# EAGLE design sch_THT (EAGLE 8.0.1)
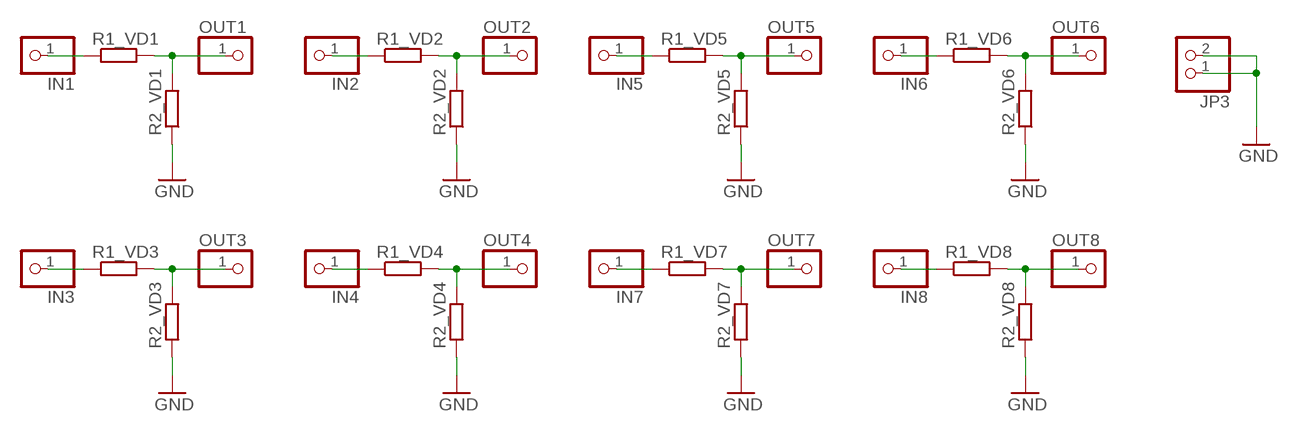
[diagram p0: schematic, sheet 1]

## Parts
IN1  PINHD-1X1  [1X01]
IN2  PINHD-1X1  [1X01]
IN3  PINHD-1X1  [1X01]
IN4  PINHD-1X1  [1X01]
IN5  PINHD-1X1  [1X01]
IN6  PINHD-1X1  [1X01]
IN7  PINHD-1X1  [1X01]
IN8  PINHD-1X1  [1X01]
JP3  PINHD-1X2  [1X02]
OUT1  PINHD-1X1  [1X01]
OUT2  PINHD-1X1  [1X01]
OUT3  PINHD-1X1  [1X01]
OUT4  PINHD-1X1  [1X01]
OUT5  PINHD-1X1  [1X01]
OUT6  PINHD-1X1  [1X01]
OUT7  PINHD-1X1  [1X01]
OUT8  PINHD-1X1  [1X01]
R1_VD1  R-EU_0204/7  [0204/7]
R1_VD2  R-EU_0204/7  [0204/7]
R1_VD3  R-EU_0204/7  [0204/7]
R1_VD4  R-EU_0204/7  [0204/7]
R1_VD5  R-EU_0204/7  [0204/7]
R1_VD6  R-EU_0204/7  [0204/7]
R1_VD7  R-EU_0204/7  [0204/7]
R1_VD8  R-EU_0204/7  [0204/7]
R2_VD1  R-EU_0204/7  [0204/7]
R2_VD2  R-EU_0204/7  [0204/7]
R2_VD3  R-EU_0204/7  [0204/7]
R2_VD4  R-EU_0204/7  [0204/7]
R2_VD5  R-EU_0204/7  [0204/7]
R2_VD6  R-EU_0204/7  [0204/7]
R2_VD7  R-EU_0204/7  [0204/7]
R2_VD8  R-EU_0204/7  [0204/7]

## Nets
GND: JP3.1 JP3.2 R2_VD1.1 R2_VD2.1 R2_VD3.1 R2_VD4.1 R2_VD5.1 R2_VD6.1 R2_VD7.1 R2_VD8.1
N$1: IN1.1 R1_VD1.1
N$2: OUT1.1 R1_VD1.2 R2_VD1.2
N$3: IN2.1 R1_VD2.1
N$4: OUT2.1 R1_VD2.2 R2_VD2.2
N$5: IN3.1 R1_VD3.1
N$6: OUT3.1 R1_VD3.2 R2_VD3.2
N$7: IN4.1 R1_VD4.1
N$8: OUT4.1 R1_VD4.2 R2_VD4.2
N$9: IN5.1 R1_VD5.1
N$10: OUT5.1 R1_VD5.2 R2_VD5.2
N$11: IN6.1 R1_VD6.1
N$12: OUT6.1 R1_VD6.2 R2_VD6.2
N$13: IN7.1 R1_VD7.1
N$14: OUT7.1 R1_VD7.2 R2_VD7.2
N$15: IN8.1 R1_VD8.1
N$16: OUT8.1 R1_VD8.2 R2_VD8.2

## Library data of the parts
IN1-IN8 OUT1-OUT8 = pinhead:PINHD-1X1: PIN HEADER
JP3 = pinhead:PINHD-1X2: PIN HEADER
R1_VD1-R1_VD8 R2_VD1-R2_VD8 = rcl:R-EU_: RESISTOR, European symbol

## Net classes
0 default: drill 0.381 mm

## Board
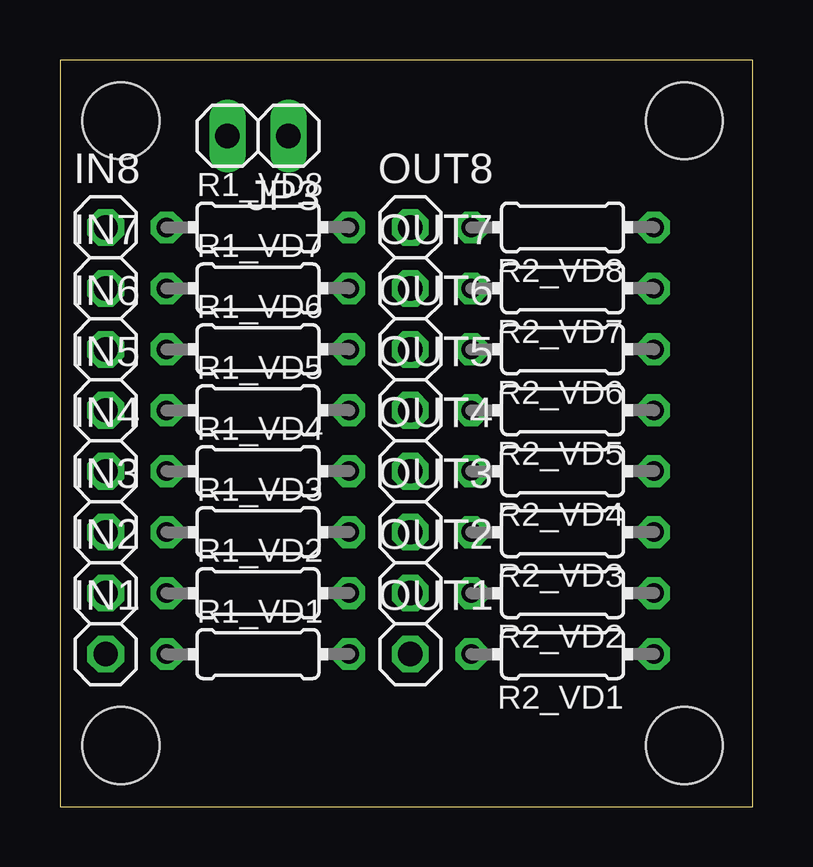
[diagram p1: board, top side]
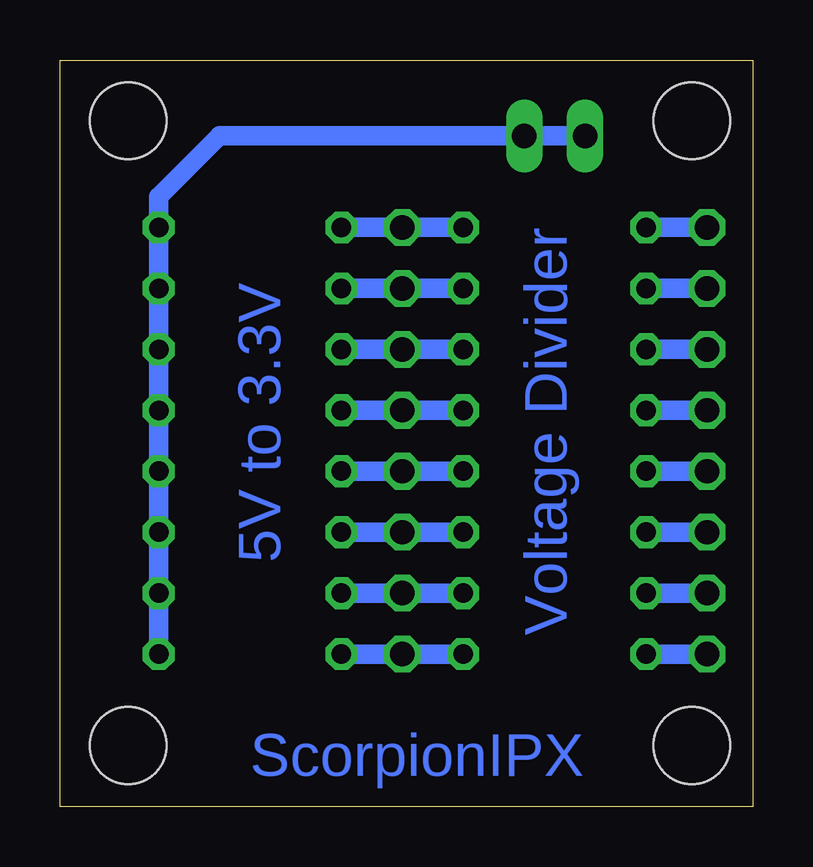
[diagram p2: board, bottom side, seen from below]

Size 28.88 x 31.11 mm. Coordinates in mm from the lower left corner, seen from the top.
Outline: 0,0 28.88,0 28.88,31.11 0,31.11 0,0
Copper layers (1*16): Top 0.035mm / dielectric 1.5mm / Bottom 0.035mm
Design rules "default": minimum track width 10mil, minimum drill 24mil, track to track 8mil, track to pad 8mil, pad to pad 8mil, via to via 8mil, smd to smd 8mil, copper to edge 40mil, drill to drill 8mil, minimum pad ring 10mil, minimum via ring 8mil, stop-mask expansion 4mil, vias tented up to drill 0mil, thermal gap 10mil
Holes 3.2 mm at 2.54,28.57 2.54,2.54 26.04,28.57 26.04,2.54

### Footprints (pad centres in the part's own frame; a part is rotated, then mirrored left to right if it is on the bottom)
1X01 = drill 1.016 octagon: 1 0,0
1X02 = drill 1.016 long: 1 -1.27,0; 2 1.27,0
0204/7 = drill 0.813 octagon: 1 -3.81,0; 2 3.81,0

### Placement (x,y rotation side)
IN1  1.91,6.35 0 top
IN2  1.91,8.89 0 top
IN3  1.91,11.43 0 top
IN4  1.91,13.97 0 top
IN5  1.91,16.51 0 top
IN6  1.91,19.05 0 top
IN7  1.91,21.59 0 top
IN8  1.91,24.13 0 top
JP3  8.26,27.94 180 top
OUT1  14.61,6.35 0 top
OUT2  14.61,8.89 0 top
OUT3  14.61,11.43 0 top
OUT4  14.61,13.97 0 top
OUT5  14.61,16.51 0 top
OUT6  14.61,19.05 0 top
OUT7  14.61,21.59 0 top
OUT8  14.61,24.13 0 top
R1_VD1  8.26,6.35 0 top
R1_VD2  8.26,8.89 0 top
R1_VD3  8.26,11.43 0 top
R1_VD4  8.26,13.97 0 top
R1_VD5  8.26,16.51 0 top
R1_VD6  8.26,19.05 0 top
R1_VD7  8.26,21.59 0 top
R1_VD8  8.26,24.13 0 top
R2_VD1  20.96,6.35 180 top
R2_VD2  20.96,8.89 180 top
R2_VD3  20.96,11.43 180 top
R2_VD4  20.96,13.97 180 top
R2_VD5  20.96,16.51 180 top
R2_VD6  20.96,19.05 180 top
R2_VD7  20.96,21.59 180 top
R2_VD8  20.96,24.13 180 top

### Tracks (layer width: path | path; a pad name or v marks a point on that pad's centre or on a via)
GND
  Bottom 0.813: R2_VD1.1 R2_VD2.1 R2_VD3.1 R2_VD4.1 R2_VD5.1 R2_VD6.1 R2_VD7.1 R2_VD8.1 24.77,25.4 22.23,27.94 JP3.1 JP3.2
N$1
  Bottom 0.813: IN1.1 R1_VD1.1
N$2
  Bottom 0.813: R2_VD1.2 OUT1.1 R1_VD1.2
N$3
  Bottom 0.813: IN2.1 R1_VD2.1
N$4
  Bottom 0.813: R1_VD2.2 OUT2.1 R2_VD2.2
N$5
  Bottom 0.813: R1_VD3.1 IN3.1
N$6
  Bottom 0.813: R2_VD3.2 OUT3.1 R1_VD3.2
N$7
  Bottom 0.813: IN4.1 R1_VD4.1
N$8
  Bottom 0.813: R1_VD4.2 OUT4.1 R2_VD4.2
N$9
  Bottom 0.813: R1_VD5.1 IN5.1
N$10
  Bottom 0.813: R2_VD5.2 OUT5.1 R1_VD5.2
N$11
  Bottom 0.813: IN6.1 R1_VD6.1
N$12
  Bottom 0.813: R1_VD6.2 OUT6.1 R2_VD6.2
N$13
  Bottom 0.813: R1_VD7.1 IN7.1
N$14
  Bottom 0.813: R2_VD7.2 OUT7.1 R1_VD7.2
N$15
  Bottom 0.813: R1_VD8.1 IN8.1
N$16
  Bottom 0.813: R1_VD8.2 OUT8.1 R2_VD8.2

### Text on the board
Bottom: Voltage Divider | 5V to 3.3V | ScorpionIPX